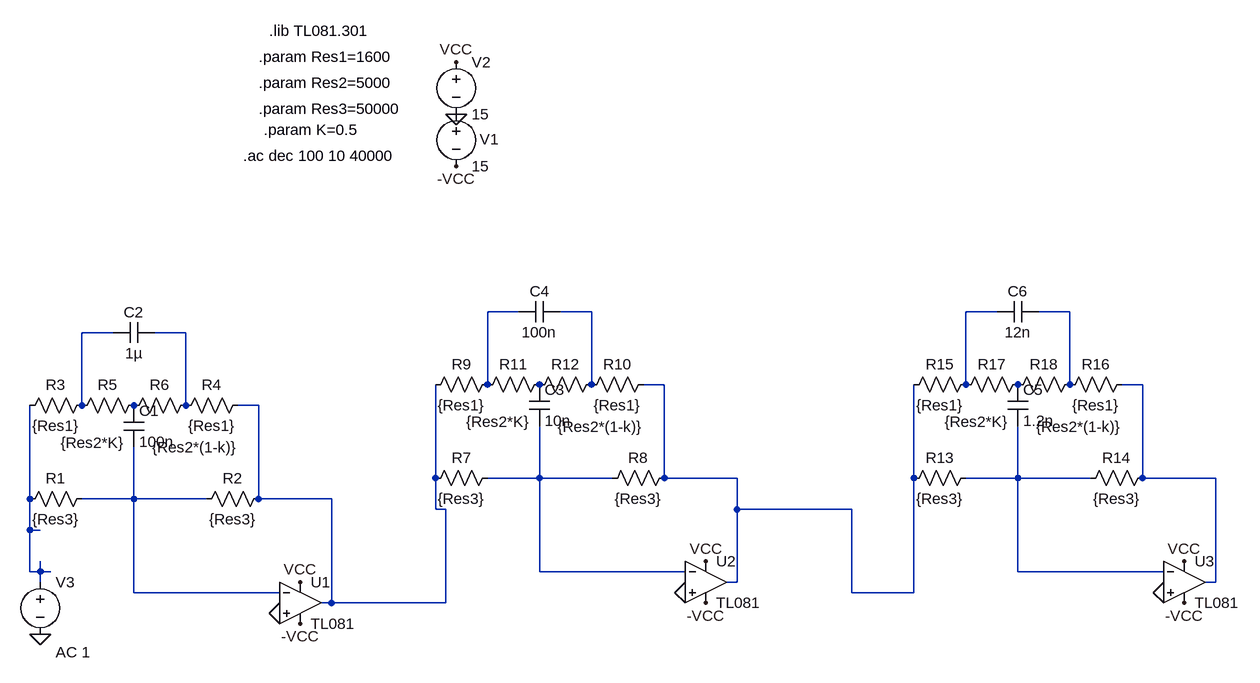
[diagram p0: schematic 3etapaCascada.asc]
3etapaCascada.asc, the LTspice schematic file:
Version 4
SHEET 1 1888 696
WIRE 624 112 576 112
WIRE 736 112 688 112
WIRE 1360 112 1312 112
WIRE 1472 112 1424 112
WIRE 0 144 -48 144
WIRE 112 144 64 144
WIRE 576 224 576 112
WIRE 736 224 736 112
WIRE 848 224 816 224
WIRE 1312 224 1312 112
WIRE 1472 224 1472 112
WIRE 1584 224 1552 224
WIRE -48 256 -48 144
WIRE 112 256 112 144
WIRE 224 256 192 256
WIRE 496 368 496 224
WIRE 656 368 656 288
WIRE 656 368 576 368
WIRE 768 368 656 368
WIRE 848 368 848 224
WIRE 960 368 848 368
WIRE 1232 368 1232 224
WIRE 1392 368 1392 288
WIRE 1392 368 1312 368
WIRE 1504 368 1392 368
WIRE 1584 368 1584 224
WIRE 1696 368 1584 368
WIRE -128 400 -128 256
WIRE 32 400 32 320
WIRE 32 400 -48 400
WIRE 144 400 32 400
WIRE 224 400 224 256
WIRE 336 400 224 400
WIRE 496 416 496 368
WIRE 512 416 496 416
WIRE 960 416 960 368
WIRE 1136 416 960 416
WIRE -128 448 -128 400
WIRE -112 448 -128 448
WIRE -128 512 -128 448
WIRE -112 512 -112 496
WIRE -112 512 -128 512
WIRE -96 512 -112 512
WIRE 656 512 656 368
WIRE 880 512 656 512
WIRE 1392 512 1392 368
WIRE 1616 512 1392 512
WIRE -112 528 -112 512
WIRE 960 528 960 416
WIRE 960 528 944 528
WIRE 1696 528 1696 368
WIRE 1696 528 1680 528
WIRE 32 544 32 400
WIRE 256 544 32 544
WIRE 1136 544 1136 416
WIRE 1232 544 1232 368
WIRE 1232 544 1136 544
WIRE 336 560 336 400
WIRE 336 560 320 560
WIRE 512 560 512 416
WIRE 512 560 336 560
FLAG 288 528 VCC
FLAG 528 -272 VCC
FLAG 288 592 -VCC
FLAG 528 -112 -VCC
FLAG 528 -192 0
FLAG 256 576 0
FLAG -112 608 0
FLAG 912 496 VCC
FLAG 912 560 -VCC
FLAG 880 544 0
FLAG 1648 496 VCC
FLAG 1648 560 -VCC
FLAG 1616 544 0
SYMBOL Opamps\\opamp2 288 496 R0
SYMATTR InstName U1
SYMATTR Value TL081
SYMBOL voltage 528 -208 R0
WINDOW 0 36 55 Left 2
WINDOW 123 0 0 Left 2
WINDOW 39 0 0 Left 2
SYMATTR InstName V1
SYMATTR Value 15
SYMBOL voltage 528 -288 R0
WINDOW 123 0 0 Left 2
WINDOW 39 0 0 Left 2
SYMATTR InstName V2
SYMATTR Value 15
SYMBOL res -32 384 R90
WINDOW 0 0 56 VBottom 2
WINDOW 3 32 56 VTop 2
SYMATTR InstName R1
SYMATTR Value {Res3}
SYMBOL res 240 384 R90
WINDOW 0 0 56 VBottom 2
WINDOW 3 32 56 VTop 2
SYMATTR InstName R2
SYMATTR Value {Res3}
SYMBOL res -32 240 R90
WINDOW 0 0 56 VBottom 2
WINDOW 3 32 56 VTop 2
SYMATTR InstName R3
SYMATTR Value {Res1}
SYMBOL res 208 240 R90
WINDOW 0 0 56 VBottom 2
WINDOW 3 32 56 VTop 2
SYMATTR InstName R4
SYMATTR Value {Res1}
SYMBOL res 48 240 R90
WINDOW 0 0 56 VBottom 2
WINDOW 3 58 80 VTop 2
SYMATTR InstName R5
SYMATTR Value {Res2*K}
SYMBOL res 128 240 R90
WINDOW 0 0 56 VBottom 2
WINDOW 3 65 2 VTop 2
SYMATTR InstName R6
SYMATTR Value {Res2*(1-k)}
SYMBOL cap 16 256 R0
SYMATTR InstName C1
SYMATTR Value 100n
SYMBOL cap 64 128 R90
WINDOW 0 0 32 VBottom 2
WINDOW 3 32 32 VTop 2
SYMATTR InstName C2
SYMATTR Value 1µ
SYMBOL voltage -112 512 R0
WINDOW 123 24 124 Left 2
WINDOW 39 0 0 Left 2
SYMATTR Value2 AC 1
SYMATTR InstName V3
SYMATTR Value ""
SYMBOL Opamps\\opamp2 912 464 R0
SYMATTR InstName U2
SYMATTR Value TL081
SYMBOL res 592 352 R90
WINDOW 0 0 56 VBottom 2
WINDOW 3 32 56 VTop 2
SYMATTR InstName R7
SYMATTR Value {Res3}
SYMBOL res 864 352 R90
WINDOW 0 0 56 VBottom 2
WINDOW 3 32 56 VTop 2
SYMATTR InstName R8
SYMATTR Value {Res3}
SYMBOL res 592 208 R90
WINDOW 0 0 56 VBottom 2
WINDOW 3 32 56 VTop 2
SYMATTR InstName R9
SYMATTR Value {Res1}
SYMBOL res 832 208 R90
WINDOW 0 0 56 VBottom 2
WINDOW 3 32 56 VTop 2
SYMATTR InstName R10
SYMATTR Value {Res1}
SYMBOL res 672 208 R90
WINDOW 0 0 56 VBottom 2
WINDOW 3 58 80 VTop 2
SYMATTR InstName R11
SYMATTR Value {Res2*K}
SYMBOL res 752 208 R90
WINDOW 0 0 56 VBottom 2
WINDOW 3 65 2 VTop 2
SYMATTR InstName R12
SYMATTR Value {Res2*(1-k)}
SYMBOL cap 640 224 R0
SYMATTR InstName C3
SYMATTR Value 10n
SYMBOL cap 688 96 R90
WINDOW 0 0 32 VBottom 2
WINDOW 3 32 32 VTop 2
SYMATTR InstName C4
SYMATTR Value 100n
SYMBOL Opamps\\opamp2 1648 464 R0
SYMATTR InstName U3
SYMATTR Value TL081
SYMBOL res 1328 352 R90
WINDOW 0 0 56 VBottom 2
WINDOW 3 32 56 VTop 2
SYMATTR InstName R13
SYMATTR Value {Res3}
SYMBOL res 1600 352 R90
WINDOW 0 0 56 VBottom 2
WINDOW 3 32 56 VTop 2
SYMATTR InstName R14
SYMATTR Value {Res3}
SYMBOL res 1328 208 R90
WINDOW 0 0 56 VBottom 2
WINDOW 3 32 56 VTop 2
SYMATTR InstName R15
SYMATTR Value {Res1}
SYMBOL res 1568 208 R90
WINDOW 0 0 56 VBottom 2
WINDOW 3 32 56 VTop 2
SYMATTR InstName R16
SYMATTR Value {Res1}
SYMBOL res 1408 208 R90
WINDOW 0 0 56 VBottom 2
WINDOW 3 58 80 VTop 2
SYMATTR InstName R17
SYMATTR Value {Res2*K}
SYMBOL res 1488 208 R90
WINDOW 0 0 56 VBottom 2
WINDOW 3 65 2 VTop 2
SYMATTR InstName R18
SYMATTR Value {Res2*(1-k)}
SYMBOL cap 1376 224 R0
SYMATTR InstName C5
SYMATTR Value 1.2n
SYMBOL cap 1424 96 R90
WINDOW 0 0 32 VBottom 2
WINDOW 3 32 32 VTop 2
SYMATTR InstName C6
SYMATTR Value 12n
TEXT 240 -320 Left 2 !.lib TL081.301
TEXT 224 -280 Left 2 !.param Res1=1600
TEXT 224 -240 Left 2 !.param Res2=5000
TEXT 224 -200 Left 2 !.param Res3=50000
TEXT 232 -168 Left 2 !.param K=0.5
TEXT 200 -128 Left 2 !.ac dec 100 10 40000

The netlist it stands for:
* 3etapaCascada.asc
XU1 0 N013 VCC -VCC N009 TL081  ; pins In+ In- V+ V- OUT
V1 0 -VCC 15
V2 VCC 0 15
R1 N013 N012 {Res3}
R2 N009 N013 {Res3}
R3 N005 N012 {Res1}
R4 N009 N006 {Res1}
R5 P001 N005 {Res2*K}
R6 N006 P001 {Res2*(1-k)}
C1 P001 N013 100n
C2 N006 N005 1µ
V3 N012 0 AC 1
XU2 0 N010 VCC -VCC N007 TL081  ; pins In+ In- V+ V- OUT
R7 N010 N009 {Res3}
R8 N007 N010 {Res3}
R9 N001 N009 {Res1}
R10 N007 N002 {Res1}
R11 P002 N001 {Res2*K}
R12 N002 P002 {Res2*(1-k)}
C3 P002 N010 10n
C4 N002 N001 100n
XU3 0 N011 VCC -VCC N008 TL081  ; pins In+ In- V+ V- OUT
R13 N011 N007 {Res3}
R14 N008 N011 {Res3}
R15 N003 N007 {Res1}
R16 N008 N004 {Res1}
R17 P003 N003 {Res2*K}
R18 N004 P003 {Res2*(1-k)}
C5 P003 N011 1.2n
C6 N004 N003 12n
.lib TL081.301
.param Res1=1600
.param Res2=5000
.param Res3=50000
.param K=0.5
.ac dec 100 10 40000
.backanno
.end